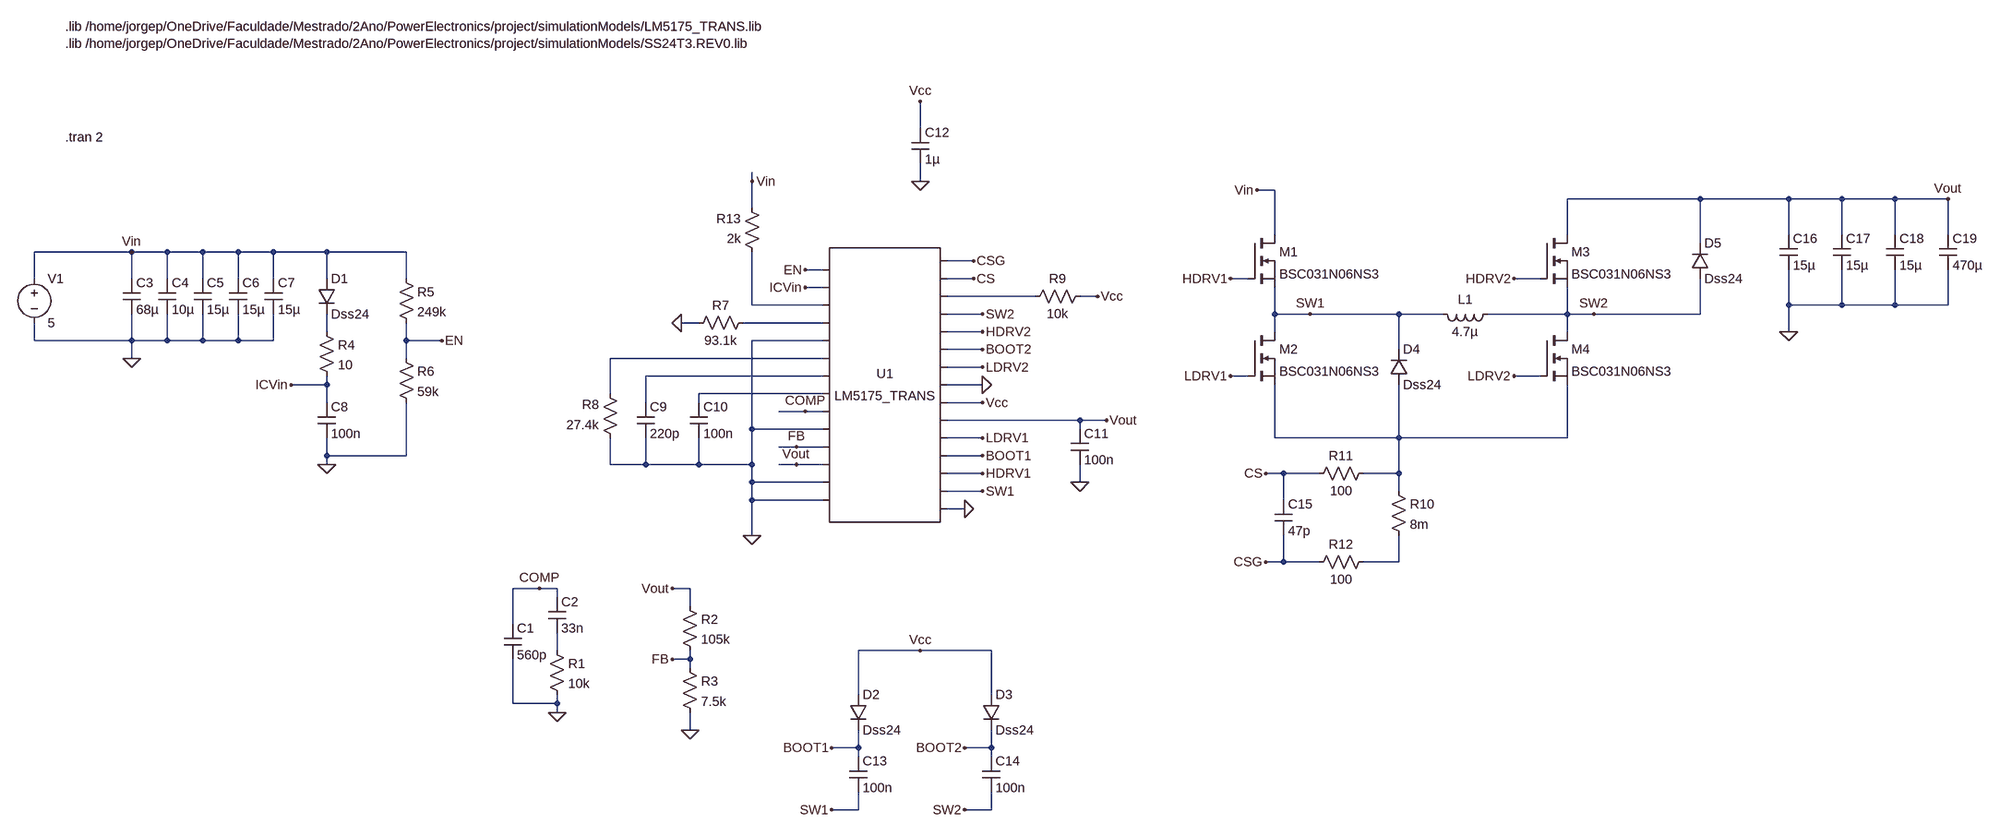
[diagram p0: schematic sim.asc]
sim.asc, the LTspice schematic file:
Version 4
SHEET 1 2436 1020
WIRE 320 -272 320 -320
WIRE 16 -176 16 -192
WIRE 320 -176 320 -208
WIRE 960 -160 928 -160
WIRE 1728 -144 1488 -144
WIRE 1888 -144 1728 -144
WIRE 1984 -144 1888 -144
WIRE 2080 -144 1984 -144
WIRE 2176 -144 2080 -144
WIRE 16 -128 16 -176
WIRE 960 -80 960 -160
WIRE 1488 -80 1488 -144
WIRE 1888 -80 1888 -144
WIRE 1984 -80 1984 -144
WIRE 2080 -80 2080 -144
WIRE 2176 -80 2176 -144
WIRE 1728 -64 1728 -144
WIRE -1104 -48 -1280 -48
WIRE -1040 -48 -1104 -48
WIRE -976 -48 -1040 -48
WIRE -912 -48 -976 -48
WIRE -848 -48 -912 -48
WIRE -752 -48 -848 -48
WIRE -608 -48 -752 -48
WIRE 416 -32 368 -32
WIRE 144 -16 112 -16
WIRE -1280 0 -1280 -48
WIRE -1104 0 -1104 -48
WIRE -1040 0 -1040 -48
WIRE -976 0 -976 -48
WIRE -912 0 -912 -48
WIRE -848 0 -848 -48
WIRE -752 0 -752 -48
WIRE -608 0 -608 -48
WIRE 416 0 368 0
WIRE 912 0 880 0
WIRE 1440 0 1392 0
WIRE 144 16 112 16
WIRE 528 32 368 32
WIRE 640 32 608 32
WIRE 16 48 16 -48
WIRE 144 48 16 48
WIRE 1888 48 1888 -16
WIRE 1984 48 1984 -16
WIRE 1984 48 1888 48
WIRE 2080 48 2080 -16
WIRE 2080 48 1984 48
WIRE 2176 48 2176 -16
WIRE 2176 48 2080 48
WIRE 432 64 368 64
WIRE 960 64 960 16
WIRE 1024 64 960 64
WIRE 1184 64 1024 64
WIRE 1264 64 1184 64
WIRE 1488 64 1488 16
WIRE 1488 64 1344 64
WIRE 1536 64 1488 64
WIRE 1728 64 1728 0
WIRE 1728 64 1536 64
WIRE -80 80 -112 80
WIRE 144 80 0 80
WIRE -752 96 -752 64
WIRE 432 96 368 96
WIRE 960 96 960 64
WIRE 1488 96 1488 64
WIRE 1888 96 1888 48
WIRE -1280 112 -1280 80
WIRE -1104 112 -1104 64
WIRE -1104 112 -1280 112
WIRE -1040 112 -1040 64
WIRE -1040 112 -1104 112
WIRE -976 112 -976 64
WIRE -976 112 -1040 112
WIRE -912 112 -912 64
WIRE -912 112 -976 112
WIRE -848 112 -848 64
WIRE -848 112 -912 112
WIRE -608 112 -608 80
WIRE -544 112 -608 112
WIRE 144 112 16 112
WIRE 432 128 368 128
WIRE 1184 128 1184 64
WIRE -1104 144 -1104 112
WIRE -608 144 -608 112
WIRE 144 144 -240 144
WIRE 432 160 368 160
WIRE 144 176 -176 176
WIRE 912 176 880 176
WIRE 1440 176 1392 176
WIRE -752 192 -752 176
WIRE -752 192 -816 192
WIRE 432 192 368 192
WIRE -240 208 -240 144
WIRE 144 208 -80 208
WIRE -752 224 -752 192
WIRE -176 224 -176 176
WIRE -80 224 -80 208
WIRE 432 224 368 224
WIRE 112 240 64 240
WIRE 144 240 112 240
WIRE 608 256 368 256
WIRE 656 256 608 256
WIRE 16 272 16 112
WIRE 144 272 16 272
WIRE 608 272 608 256
WIRE 432 288 368 288
WIRE 960 288 960 192
WIRE 1184 288 1184 192
WIRE 1184 288 960 288
WIRE 1488 288 1488 192
WIRE 1488 288 1184 288
WIRE 96 304 64 304
WIRE 144 304 96 304
WIRE -752 320 -752 288
WIRE -608 320 -608 224
WIRE -608 320 -752 320
WIRE 432 320 368 320
WIRE -752 336 -752 320
WIRE -240 336 -240 288
WIRE -176 336 -176 288
WIRE -176 336 -240 336
WIRE -80 336 -80 288
WIRE -80 336 -176 336
WIRE 16 336 16 272
WIRE 16 336 -80 336
WIRE 96 336 64 336
WIRE 144 336 96 336
WIRE 432 352 368 352
WIRE 976 352 944 352
WIRE 1040 352 976 352
WIRE 1184 352 1184 288
WIRE 1184 352 1120 352
WIRE 16 368 16 336
WIRE 144 368 16 368
WIRE 608 368 608 336
WIRE 432 384 368 384
WIRE 1184 384 1184 352
WIRE 16 400 16 368
WIRE 144 400 16 400
WIRE 976 400 976 352
WIRE 400 416 368 416
WIRE 16 464 16 400
WIRE 976 512 976 464
WIRE 976 512 944 512
WIRE 1040 512 976 512
WIRE 1184 512 1184 464
WIRE 1184 512 1120 512
WIRE -368 560 -416 560
WIRE -336 560 -368 560
WIRE -96 560 -128 560
WIRE -336 576 -336 560
WIRE -96 592 -96 560
WIRE -416 624 -416 560
WIRE -336 672 -336 640
WIRE 320 672 208 672
WIRE 448 672 320 672
WIRE -96 688 -96 672
WIRE -96 688 -128 688
WIRE -96 704 -96 688
WIRE 208 752 208 672
WIRE 448 752 448 672
WIRE -416 768 -416 688
WIRE -336 768 -336 752
WIRE -336 768 -416 768
WIRE -336 784 -336 768
WIRE -96 816 -96 784
WIRE 208 848 208 816
WIRE 208 848 160 848
WIRE 448 848 448 816
WIRE 448 848 400 848
WIRE 208 864 208 848
WIRE 448 864 448 848
WIRE 208 960 208 928
WIRE 208 960 160 960
WIRE 448 960 448 928
WIRE 448 960 400 960
FLAG 16 464 0
FLAG -336 784 0
FLAG 112 240 COMP
FLAG -368 560 COMP
FLAG 96 336 Vout
FLAG 96 304 FB
FLAG -96 816 0
FLAG -128 688 FB
FLAG -128 560 Vout
FLAG -1104 -48 Vin
FLAG -1104 144 0
FLAG -752 336 0
FLAG -816 192 ICVin
FLAG -544 112 EN
FLAG 112 -16 EN
FLAG 112 16 ICVin
FLAG -112 80 0
FLAG 416 -32 CSG
FLAG 640 32 Vcc
FLAG 432 224 Vcc
FLAG 432 192 0
FLAG 432 160 LDRV2
FLAG 432 96 HDRV2
FLAG 432 288 LDRV1
FLAG 432 352 HDRV1
FLAG 656 256 Vout
FLAG 608 368 0
FLAG 320 -176 0
FLAG 320 -320 Vcc
FLAG 432 320 BOOT1
FLAG 432 128 BOOT2
FLAG 432 384 SW1
FLAG 432 64 SW2
FLAG 400 416 0
FLAG 320 672 Vcc
FLAG 160 848 BOOT1
FLAG 160 960 SW1
FLAG 400 848 BOOT2
FLAG 400 960 SW2
FLAG 928 -160 Vin
FLAG 880 0 HDRV1
FLAG 880 176 LDRV1
FLAG 1392 0 HDRV2
FLAG 1392 176 LDRV2
FLAG 1024 64 SW1
FLAG 1536 64 SW2
FLAG 944 512 CSG
FLAG 1888 96 0
FLAG 2176 -144 Vout
FLAG 944 352 CS
FLAG 416 0 CS
FLAG 16 -176 Vin
SYMBOL AutoGenerated\\LM5175_TRANS 256 192 R0
SYMATTR InstName U1
SYMBOL cap -432 624 R0
SYMATTR InstName C1
SYMATTR Value 560p
SYMBOL cap -352 576 R0
SYMATTR InstName C2
SYMATTR Value 33n
SYMBOL res -352 656 R0
SYMATTR InstName R1
SYMATTR Value 10k
SYMBOL res -112 576 R0
SYMATTR InstName R2
SYMATTR Value 105k
SYMBOL res -112 688 R0
SYMATTR InstName R3
SYMATTR Value 7.5k
SYMBOL cap -1120 0 R0
SYMATTR InstName C3
SYMATTR Value 68µ
SYMBOL cap -1056 0 R0
SYMATTR InstName C4
SYMATTR Value 10µ
SYMBOL cap -992 0 R0
SYMATTR InstName C5
SYMATTR Value 15µ
SYMBOL cap -928 0 R0
SYMATTR InstName C6
SYMATTR Value 15µ
SYMBOL cap -864 0 R0
SYMATTR InstName C7
SYMATTR Value 15µ
SYMBOL diode -768 0 R0
SYMATTR InstName D1
SYMATTR Value Dss24
SYMBOL res -768 80 R0
SYMATTR InstName R4
SYMATTR Value 10
SYMBOL cap -768 224 R0
SYMATTR InstName C8
SYMATTR Value 100n
SYMBOL res -624 -16 R0
SYMATTR InstName R5
SYMATTR Value 249k
SYMBOL res -624 128 R0
SYMATTR InstName R6
SYMATTR Value 59k
SYMBOL res 16 64 R90
WINDOW 0 0 56 VBottom 2
WINDOW 3 32 56 VTop 2
SYMATTR InstName R7
SYMATTR Value 93.1k
SYMBOL res -224 304 R180
WINDOW 0 36 76 Left 2
WINDOW 3 36 40 Left 2
SYMATTR InstName R8
SYMATTR Value 27.4k
SYMBOL cap -192 224 R0
SYMATTR InstName C9
SYMATTR Value 220p
SYMBOL cap -96 224 R0
SYMATTR InstName C10
SYMATTR Value 100n
SYMBOL res 624 16 R90
WINDOW 0 0 56 VBottom 2
WINDOW 3 32 56 VTop 2
SYMATTR InstName R9
SYMATTR Value 10k
SYMBOL cap 592 272 R0
SYMATTR InstName C11
SYMATTR Value 100n
SYMBOL cap 304 -272 R0
SYMATTR InstName C12
SYMATTR Value 1µ
SYMBOL diode 192 752 R0
SYMATTR InstName D2
SYMATTR Value Dss24
SYMBOL diode 432 752 R0
SYMATTR InstName D3
SYMATTR Value Dss24
SYMBOL cap 192 864 R0
SYMATTR InstName C13
SYMATTR Value 100n
SYMBOL cap 432 864 R0
SYMATTR InstName C14
SYMATTR Value 100n
SYMBOL nmos 912 -80 R0
SYMATTR InstName M1
SYMATTR Value BSC031N06NS3
SYMBOL nmos 912 96 R0
SYMATTR InstName M2
SYMATTR Value BSC031N06NS3
SYMBOL nmos 1440 -80 R0
SYMATTR InstName M3
SYMATTR Value BSC031N06NS3
SYMBOL nmos 1440 96 R0
SYMATTR InstName M4
SYMATTR Value BSC031N06NS3
SYMBOL ind 1360 48 R90
WINDOW 0 5 56 VBottom 2
WINDOW 3 32 56 VTop 2
SYMATTR InstName L1
SYMATTR Value 4.7µ
SYMBOL diode 1168 192 M180
WINDOW 0 24 64 Left 2
WINDOW 3 24 0 Left 2
SYMATTR InstName D4
SYMATTR Value Dss24
SYMBOL diode 1712 0 M180
WINDOW 0 24 64 Left 2
WINDOW 3 24 0 Left 2
SYMATTR InstName D5
SYMATTR Value Dss24
SYMBOL res 1168 368 R0
SYMATTR InstName R10
SYMATTR Value 8m
SYMBOL res 1136 336 R90
WINDOW 0 0 56 VBottom 2
WINDOW 3 32 56 VTop 2
SYMATTR InstName R11
SYMATTR Value 100
SYMBOL res 1136 496 R90
WINDOW 0 0 56 VBottom 2
WINDOW 3 32 56 VTop 2
SYMATTR InstName R12
SYMATTR Value 100
SYMBOL cap 960 400 R0
SYMATTR InstName C15
SYMATTR Value 47p
SYMBOL cap 1872 -80 R0
SYMATTR InstName C16
SYMATTR Value 15µ
SYMBOL cap 1968 -80 R0
SYMATTR InstName C17
SYMATTR Value 15µ
SYMBOL cap 2064 -80 R0
SYMATTR InstName C18
SYMATTR Value 15µ
SYMBOL cap 2160 -80 R0
SYMATTR InstName C19
SYMATTR Value 470µ
SYMBOL voltage -1280 -16 R0
SYMATTR InstName V1
SYMATTR Value 5
SYMBOL res 32 -32 R180
WINDOW 0 36 76 Left 2
WINDOW 3 36 40 Left 2
SYMATTR InstName R13
SYMATTR Value 2k
TEXT -1224 -456 Left 2 !.lib /home/jorgep/OneDrive/Faculdade/Mestrado/2Ano/PowerElectronics/project/simulationModels/LM5175_TRANS.lib\n.lib /home/jorgep/OneDrive/Faculdade/Mestrado/2Ano/PowerElectronics/project/simulationModels/SS24T3.REV0.lib
TEXT -1224 -256 Left 2 !.tran 2

The netlist it stands for:
* sim.asc
* U1: LM5175_TRANS (symbol AutoGenerated\LM5175_TRANS not available, pins judged from their places): pin1=EN pin2=ICVin pin3=N002 pin4=N003 pin5=0 pin6=N005 pin7=N006 pin8=N007 pin9=COMP pin10=0 pin11=FB pin12=Vout pin13=0 pin14=0 pin15=CSG pin16=CS pin17=N001 pin18=SW2 pin19=HDRV2 pin20=BOOT2 pin21=LDRV2 pin22=0 pin23=Vcc pin24=Vout pin25=LDRV1 pin26=BOOT1 pin27=HDRV1 pin28=SW1 pin29=0
C1 COMP 0 560p
C2 COMP N010 33n
R1 N010 0 10k
R2 Vout FB 105k
R3 FB 0 7.5k
C3 Vin 0 68µ
C4 Vin 0 10µ
C5 Vin 0 15µ
C6 Vin 0 15µ
C7 Vin 0 15µ
D1 Vin N004 Dss24
R4 N004 ICVin 10
C8 ICVin 0 100n
R5 Vin EN 249k
R6 EN 0 59k
R7 N003 0 93.1k
R8 0 N005 27.4k
C9 N006 0 220p
C10 N007 0 100n
R9 Vcc N001 10k
C11 Vout 0 100n
C12 Vcc 0 1µ
D2 Vcc BOOT1 Dss24
D3 Vcc BOOT2 Dss24
C13 BOOT1 SW1 100n
C14 BOOT2 SW2 100n
M1 Vin HDRV1 SW1 SW1 BSC031N06NS3
M2 SW1 LDRV1 N008 N008 BSC031N06NS3
M3 Vout HDRV2 SW2 SW2 BSC031N06NS3
M4 SW2 LDRV2 N008 N008 BSC031N06NS3
L1 SW2 SW1 4.7µ
D4 N008 SW1 Dss24
D5 SW2 Vout Dss24
R10 N008 N009 8m
R11 N008 CS 100
R12 N009 CSG 100
C15 CS CSG 47p
C16 Vout 0 15µ
C17 Vout 0 15µ
C18 Vout 0 15µ
C19 Vout 0 470µ
V1 Vin 0 5
R13 N002 Vin 2k
.model D D
.lib standard.dio
.model NMOS NMOS
.model PMOS PMOS
.lib standard.mos
.lib /home/jorgep/OneDrive/Faculdade/Mestrado/2Ano/PowerElectronics/project/simulationModels/LM5175_TRANS.lib
.lib /home/jorgep/OneDrive/Faculdade/Mestrado/2Ano/PowerElectronics/project/simulationModels/SS24T3.REV0.lib
.tran 2
.backanno
.end